# EAGLE design canbus_boosterpack-mcp2551-v1 (EAGLE 5.11)
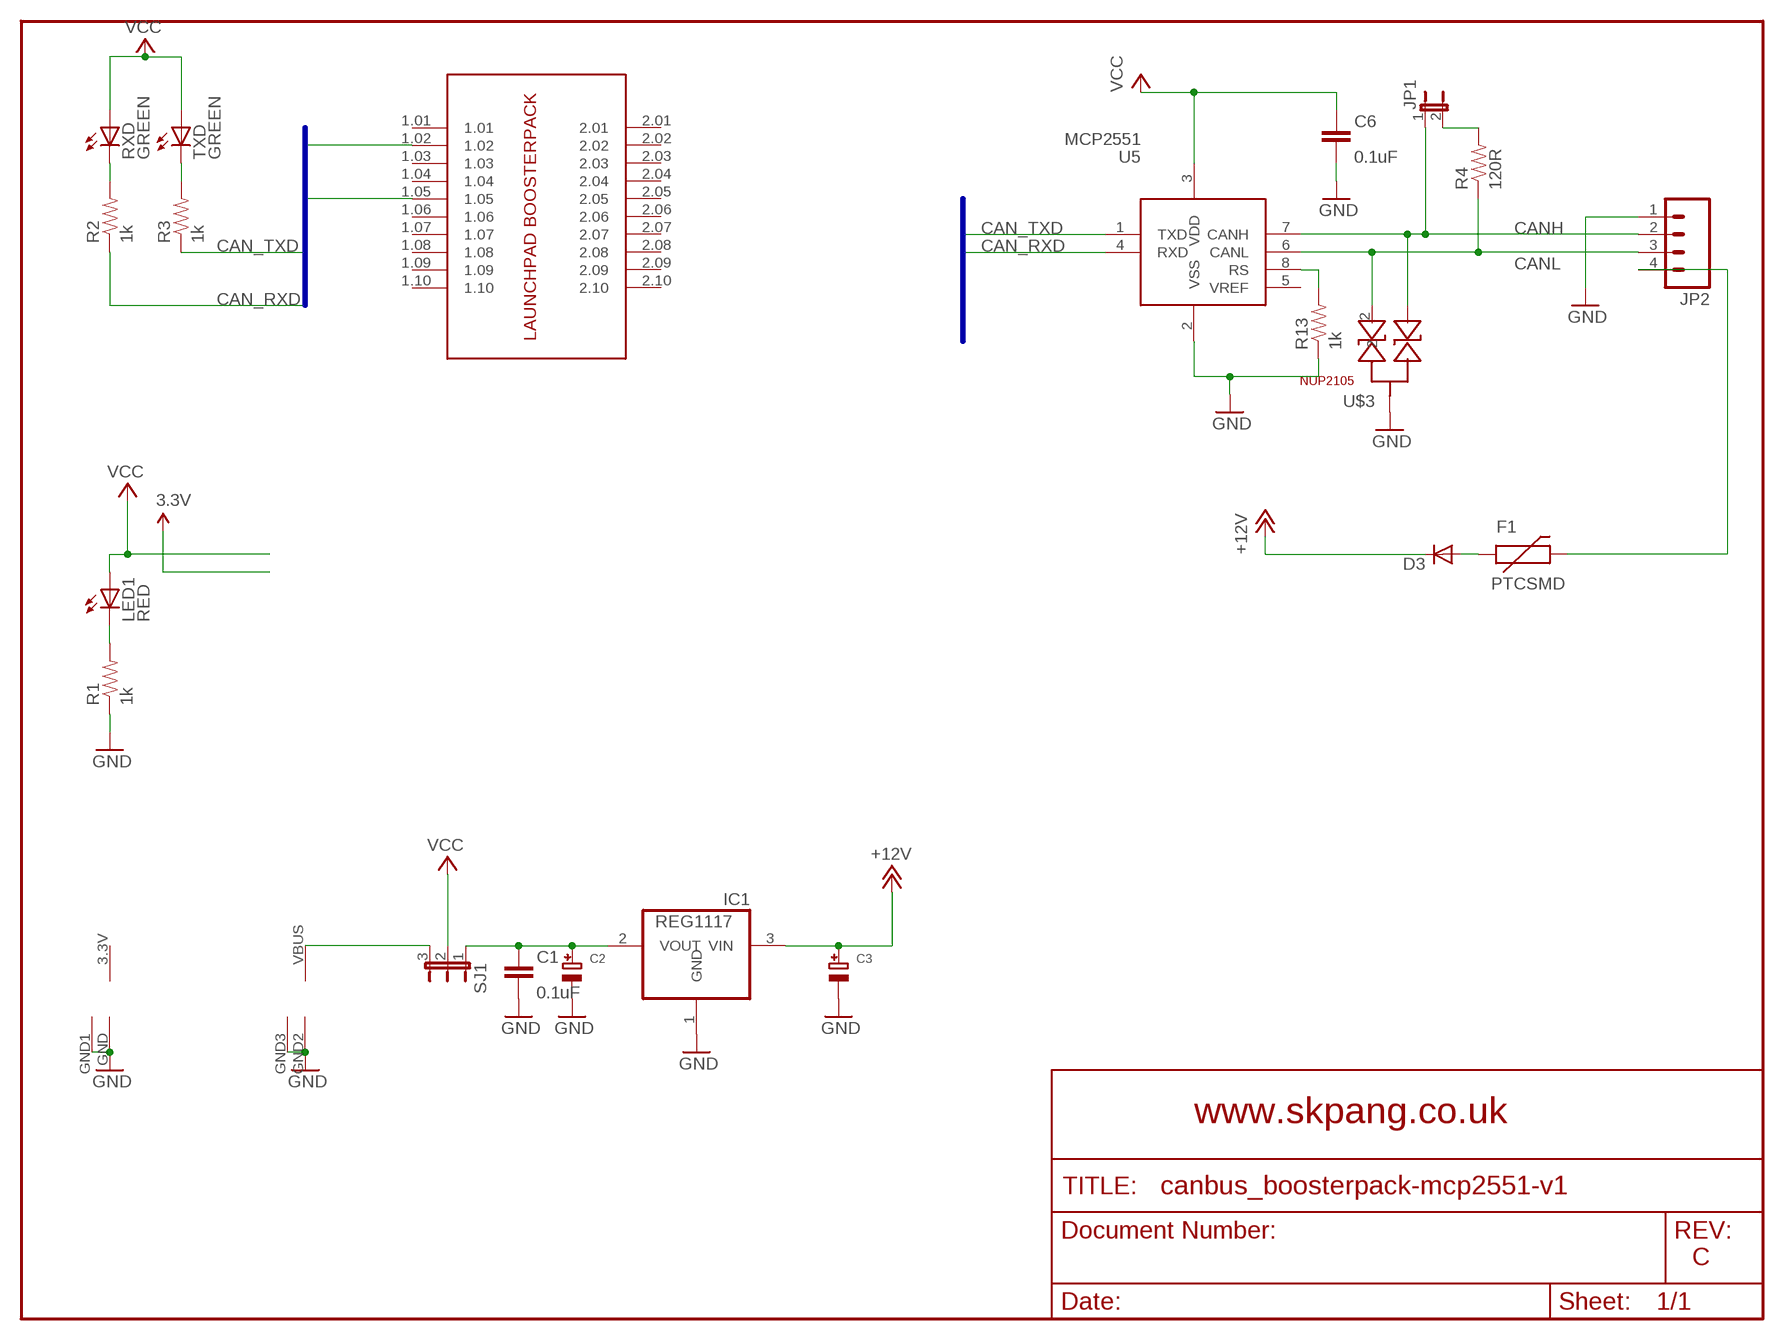
[diagram p0: schematic, sheet 1]

## Parts
C1  0.1uF  CAP0603-CAP  [0603-CAP]
C2  CAP_TANTALUMB/3528_REFLOW  [EIA3528-21/B-R]
C3  CAP_TANTALUMB/3528_REFLOW  [EIA3528-21/B-R]
C6  0.1uF  CAP0603-CAP  [0603-CAP]
D3  DIODESMB  [SMB-DIODE]
F1  PTCSMD  [PTC-1206]
IC1  REG1117  [SOT223]
JP1  JUMPER2  [JUMPER2]
JP2  M04LONGPADS  [1X04_LONGPADS]
LED1  RED  LED-0805  [LED-805]
R1  1k  RESISTOR0603-RES  [0603-RES]
R2  1k  RESISTOR0603-RES  [0603-RES]
R3  1k  RESISTOR0603-RES  [0603-RES]
R4  120R  RESISTOR0805-RES  [0805]
R13  1k  RESISTOR0805-RES  [0805]
RXD  GREEN  LED-0805  [LED-805]
SJ1  JUMPER3  [JUMPER3]
TXD  GREEN  LED-0805  [LED-805]
U5  MCP2551  [SO-08M]
U$3  NUP2105L  [DBZ_R-PDSO-G3]
U$4  LAUNCHPAD-BOOSTERPACK  [BOOSTERPACK]

## Nets
+12V: C3.+ D3.C IC1.3(VIN)
CAN_RXD: R2.1 U5.4(RXD) U$4.1.05
CAN_TXD: R3.1 U5.1(TXD) U$4.1.02
CANH: JP1.1 JP2.2 U5.7(CANH) U$3.1
CANL: JP2.3 R4.1 U5.6(CANL) U$3.2
GND: C1.1 C2.- C3.- C6.1 IC1.1(GND) JP2.1 R1.1 R13.1 U5.2(VSS) U$3.3 U$4.GND1(POWER_3.3V:GND1) U$4.GND2(POWER_VBUS:GND) U$4.GND3(POWER_VBUS:GND1) U$4.GND(POWER_3.3V:GND)
N$1: SJ1.3 U$4.VBUS(POWER_VBUS:VDD)
N$2: C1.2 C2.+ IC1.2(VOUT) SJ1.1
N$3: JP1.2 R4.2
N$4: LED1.C R1.2
N$5: R2.2 RXD.C
N$6: R3.2 TXD.C
N$13: F1.2 JP2.4
N$14: R13.2 U5.8(RS)
N$16: D3.A F1.1
VCC: C6.2 LED1.A RXD.A SJ1.2 TXD.A U5.3(VDD)
Unconnected: U5.5(VREF) U$4.1.01 U$4.1.03 U$4.1.04 U$4.1.06 U$4.1.07 U$4.1.08 U$4.1.09 U$4.1.10 U$4.2.01 U$4.2.02 U$4.2.03 U$4.2.04 U$4.2.05 U$4.2.06 U$4.2.07 U$4.2.08 U$4.2.09 U$4.2.10

## Buses
CAN_TXD,CAN_RXD

## Notes on the sheet
- www.skpang.co.uk
- C

## Power pins joined to a net without a drawn wire
VDD: U$4.3.3V(POWER_3.3V:VDD)

## Library data of the parts
C1 C6 = SparkFun:CAP: Capacitor Standard 0603 ceramic capacitor, and 0.1" leaded capacitor.
C2 C3 = microbuilder:CAP_TANTALUM: Tantalum Capacitors Wave footprints have larger pads and are meant to be used for hand soldering. Reflow footprints are optimised for solder paste and a reflow oven. EIA3216-18/A-[R/W] - Size A / 3216-18 / 1206 footprint 4.7µF 25V 10% Tantalum Capacitor 10µF 16V 10% Tantalum Capacitor [Digikey: 495-2236-2-ND] EIA3528-21/B-[R/W] - Size B / 3528-21 47µF 10V 10% Tantalum Capactior [Digikey: 495-2216-1-ND] EIA6032-28/C-[R/W] - Size C / 6032-28 10µF 35V 20% Tantalum Capacitor [Digikey: 495-2285-1-ND] 100µF 16V 10% Tantalum Capactior [Digikey: 399-5214-1-ND]
D3 = SparkFun:DIODE: Diode These are standard reverse protection diodes and small signal diodes. SMA package can handle up to about 1A. SOD-323 can handle about 200mA. What the SOD-323 package when ordering, there are some mfgs out there that are 5-pin packages.
F1 = SparkFun:PTC: Resettable Fuse PTC Resettable Fuse. Spark Fun Electronics SKU : COM-08357
IC1 = burr-brown:REG1117: 800mA and 1A Low Dropout (LDO) Positive Regulator 1.8V, 2.5V, 2.85V, 3.3V, 5V, and Adj; MPN: REG1117; OC_FARNELL: 1097566; OC_NEWARK: 14P6981
JP1 = microbuilder:JUMPER2: JUMPER - 2 Pins
JP2 = SparkFun:M04: Header 4 Standard 4-pin 0.1" header. Use with straight break away headers (SKU : PRT-00116), right angle break away headers (PRT-00553), swiss pins (PRT-00743), machine pins (PRT-00117), and female headers (PRT-00115). Molex polarized connector foot print use with SKU : PRT-08231 with associated crimp pins and housings. 1MM SMD Version SKU: PRT-10208
LED1 RXD TXD = dp_devices:LED: Light Emitting Diode
R1-R4 R13 = SparkFun:RESISTOR: Resistor Basic schematic elements and footprints for 0603, 1206, and PTH resistors.
SJ1 = microbuilder:JUMPER3: JUMPER - 3 Pins
U5 = skpang_lib:MCP2551
U$3 = mic-misc:NUP2105L
U$4 = mic-misc:LAUNCHPAD-BOOSTERPACK

## Board
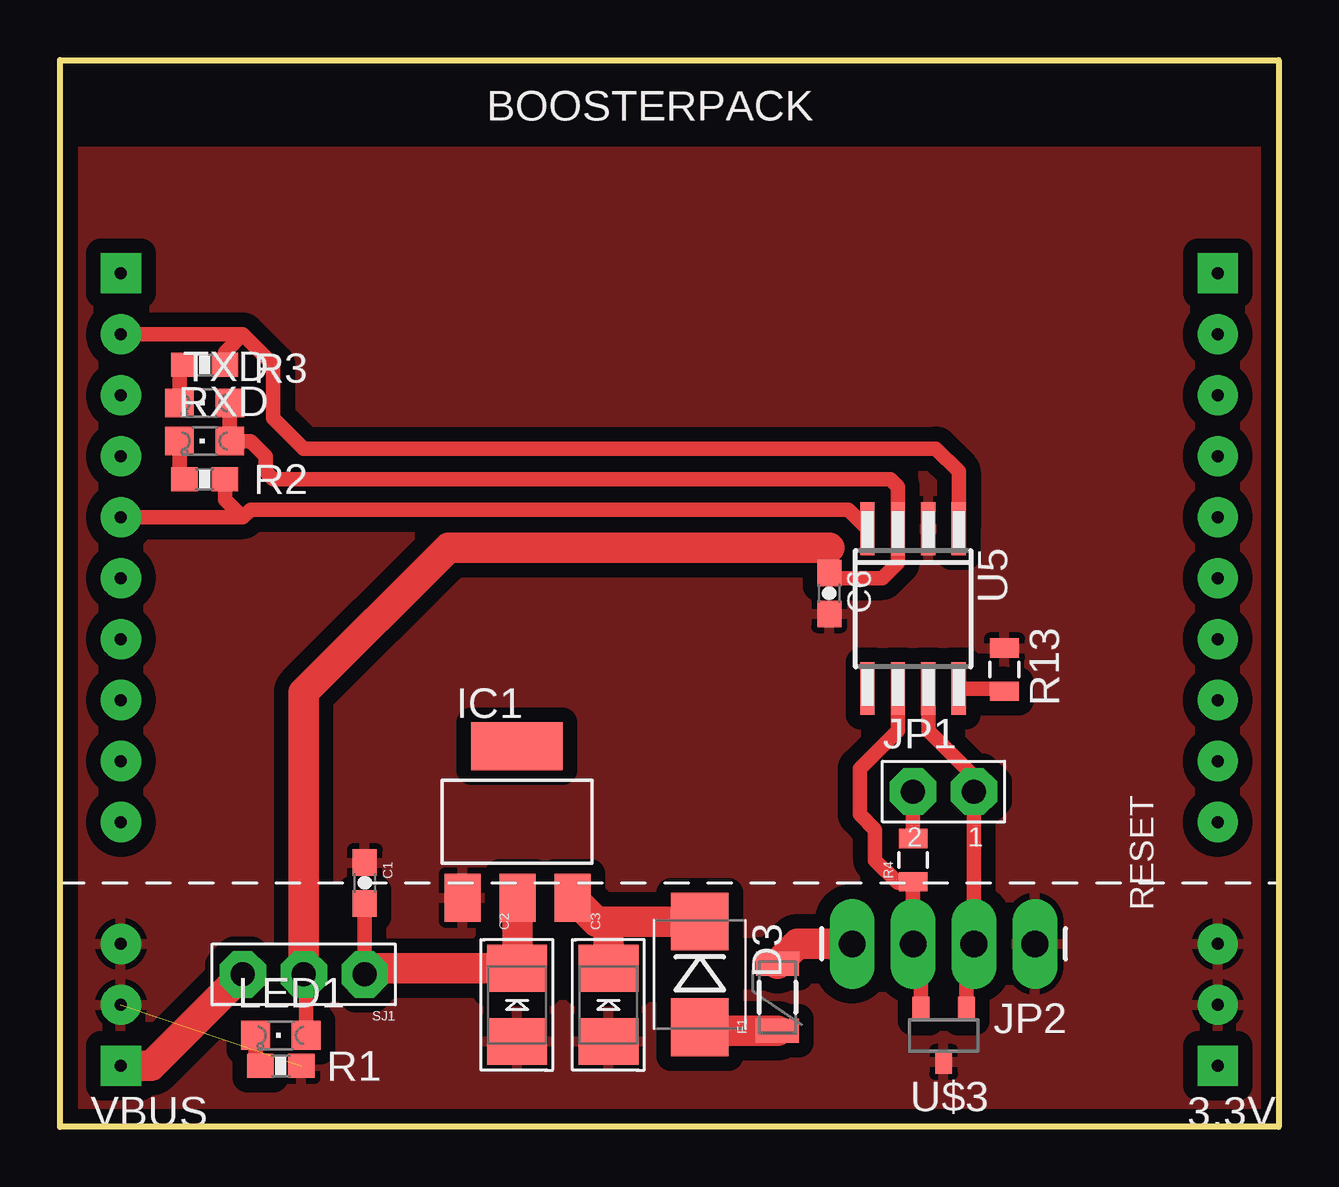
[diagram p1: board, top side]

Size 50.8 x 44.45 mm. Coordinates in mm from the lower left corner, seen from the top.
Outline: 0,0 0,44.45 50.8,44.45 50.8,0 0,0
Copper layers (1*16): Top 0.035mm / dielectric 1.5mm / Bottom 0.035mm
Design rules "SparkFun": minimum track width 8mil, minimum drill 20mil, track to track 8mil, track to pad 8mil, pad to pad 8mil, via to via 8mil, smd to smd 8mil, copper to edge 8mil, drill to drill 8mil, minimum pad ring 12mil, minimum via ring 10mil, stop-mask expansion 4mil, vias tented up to drill 20mil, thermal gap 10mil

### Footprints (pad centres in the part's own frame; a part is rotated, then mirrored left to right if it is on the bottom)
0603-CAP = smd 1.1 x 1: 1 -0.85,0; 2 0.85,0
EIA3528-21/B-R = smd 1.95 x 2.5: + 1.525,0; - -1.525,0
SMB-DIODE = smd 2.4 x 2.4: A 2.2,0; C -2.2,0
PTC-1206 = smd 1 x 1.8: 1 -1.4,0; 2 1.4,0
SOT223 = smd 1.499 x 2.007: 1 -2.261,-3.15; 2 0.025,-3.15; 3 2.311,-3.15 | smd 3.81 x 2.007: 4 0,3.15
JUMPER2 = drill 1 pad 1.93 octagon: 1 2.54,0; 2 0,0
1X04_LONGPADS = drill 1.118 pad 1.88 long: 1 0,0; 2 2.54,0; 3 5.08,0; 4 7.62,0
LED-805 = smd 1.2 x 1.2: A 0,-1.05; C 0,1.05
0603-RES = smd 1.1 x 1: 1 -0.85,0; 2 0.85,0
0805 = smd 0.8 x 1.2: 1 -0.9,0; 2 0.9,0
JUMPER3 = drill 1 pad 1.93 octagon: 1 -2.54,0; 2 0,0; 3 2.54,0
SO-08M = smd 0.6 x 2.2: 1 -1.905,-3.33; 2 -0.635,-3.33; 3 0.635,-3.33; 4 1.905,-3.33; 5 1.905,3.33; 6 0.635,3.33; 7 -0.635,3.33; 8 -1.905,3.33
DBZ_R-PDSO-G3 = smd 0.7 x 1: 1 -0.95,-1.1; 2 0.95,-1.1; 3 0,1.1
BOOSTERPACK = drill 0.5 pad 1.676 square: 1.01 -21.59,11.43; 2.01 24.13,11.43; 3.3V 24.13,-21.59; VBUS -21.59,-21.59 | drill 0.5 pad 1.676 round: 1.02 -21.59,8.89; 1.03 -21.59,6.35; 1.04 -21.59,3.81; 1.05 -21.59,1.27; 1.06 -21.59,-1.27; 1.07 -21.59,-3.81; 1.08 -21.59,-6.35; 1.09 -21.59,-8.89; 1.10 -21.59,-11.43; 2.02 24.13,8.89; 2.03 24.13,6.35; 2.04 24.13,3.81; 2.05 24.13,1.27; 2.06 24.13,-1.27; 2.07 24.13,-3.81; 2.08 24.13,-6.35; 2.09 24.13,-8.89; 2.10 24.13,-11.43; GND 24.13,-19.05; GND1 24.13,-16.51; GND2 -21.59,-19.05; GND3 -21.59,-16.51

### Placement (x,y rotation side)
C1  12.7,10.16 270 top
C2  19.05,5.08 90 top
C3  22.86,5.08 90 top
C6  32.07,22.23 90 top
D3  26.67,6.35 270 top
F1  29.91,5.4 90 top
IC1  19.05,12.7 0 top
JP1  35.56,13.97 0 top
JP2  40.64,7.62 180 top
LED1  9.21,3.81 90 top
R1  9.21,2.54 180 top
R2  6.03,26.99 180 top
R3  6.03,31.75 180 top
R4  35.56,11.11 90 top
R13  39.37,19.05 270 top
RXD  6.03,28.57 90 top
SJ1  10.16,6.35 180 top
TXD  6.03,30.16 90 top
U5  35.56,21.59 180 top
U$1  CREATIVE_COMMONS  [CREATIVE_COMMONS]  20.32,-11.43 0 top  (outside the outline)
U$3  36.83,3.81 180 top
U$4  24.13,24.13 0 top

### Tracks (layer width: path | path; a pad name or v marks a point on that pad's centre or on a via)
+12V
  Top 1.27: 22.86,8.55 22.36,8.55 IC1.3 | 22.86,8.55 D3.C | C3.+ 22.86,8.55
CAN_RXD
  Top 0.61: U$4.1.05 7.62,25.4 | R2.1 6.88,26.14 7.62,25.4 | 7.62,25.4 7.94,25.72 32.86,25.72 U5.4
CAN_TXD
  Top 0.61: U5.1 37.47,27.3 36.51,28.26 10.16,28.26 8.89,29.53 8.89,31.75 7.62,33.02 | U$4.1.02 7.62,33.02 | R3.1 6.88,32.28 7.62,33.02
CANH
  Top 0.61: U5.7 36.2,16.51 38.1,14.61 JP1.1 JP2.2 37.78,7.3 U$3.1
CANL
  Top 0.61: U5.6 34.92,16.51 33.34,14.92 33.34,13.02 33.97,12.38 33.97,11.11 34.92,10.16 35.51,10.16 R4.1 JP2.3 35.88,7.3 U$3.2
GND  (1 unrouted)
  pour Top (isolate 0.61): 0,40.64 50.8,40.64 50.8,0 0,0
N$1
  Top 1.27: U$4.VBUS 3.81,2.54 SJ1.3
N$2
  Top 0.61: SJ1.1 C1.2
  Top 1.27: IC1.2 19.07,6.63 C2.+ 12.96,6.61 SJ1.1
N$3
  Top 0.61: R4.2 JP1.2
N$4
  Top 0.61: LED1.C 8.16,2.74 R1.2
N$5
  Top 0.61: RXD.C 4.98,27.19 R2.2
N$6
  Top 0.61: TXD.C 4.98,31.55 R3.2
N$13
  Top 1.27: JP2.4 30.73,7.62 F1.2
N$14
  Top 0.61: U5.8 39.31,18.26 R13.2
N$16
  Top 1.27: F1.1 26.67,4 D3.A
VCC
  Top 0.61: TXD.A RXD.A 7.94,28.57 8.57,27.94 8.57,27.3 8.89,26.99 34.61,26.99 34.92,26.67 U5.3 34.92,23.5 34.29,22.86 31.96,22.86 C6.2 32.07,24.13 | LED1.A 10.26,6.25 SJ1.2
  Top 1.27: SJ1.2 10.16,18.1 16.19,24.13 32.07,24.13

### Text on the board
tNames: RESET
tValues: Sukking Pang and Ryan Owens